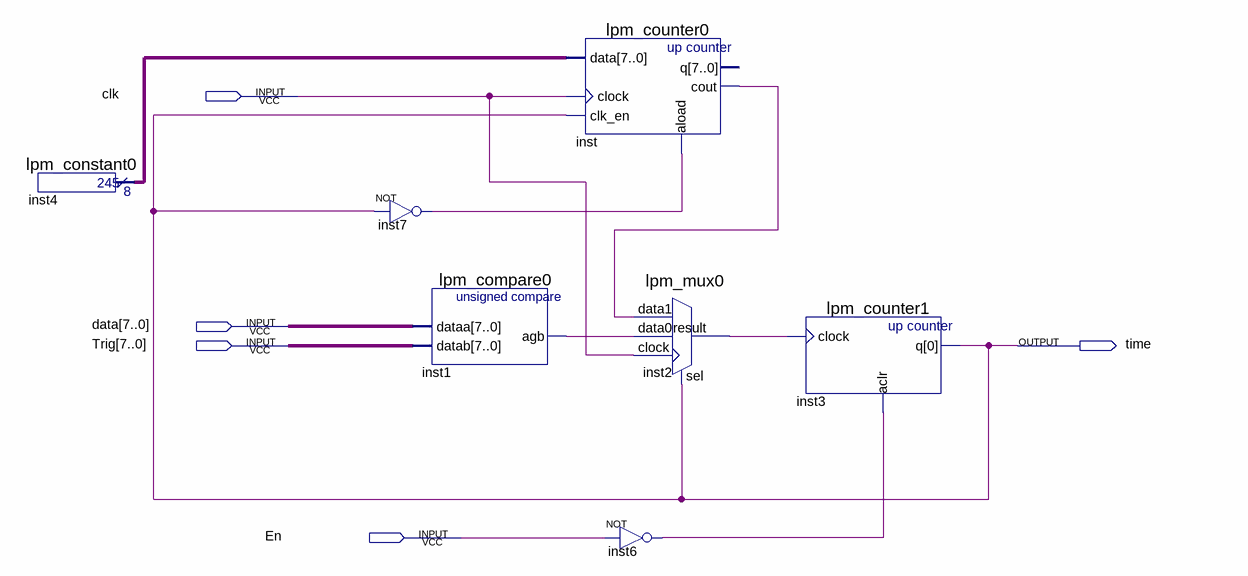
[diagram p0: schematic sheet]
// Quartus schematic time.bdf as structural Verilog: 7 symbols, 5 pins
module \time  (
  input  clk,
  input  [7:0] data,
  input  [7:0] Trig,
  input  En,
  output \time 
);

  wire inst1_agb, inst2_result, inst6_out, inst7_out, inst_cout;
  wire [7:0] inst4_result;

  lpm_constant0 inst4 (.result(inst4_result));
  not inst7 (inst7_out, \time );
  lpm_compare0 inst1 (.dataa(data), .datab(Trig), .agb(inst1_agb));
  lpm_counter0 inst (
    .data(inst4_result), .clock(clk), .clk_en(\time ), .aload(inst7_out), .cout(inst_cout));  // open: q
  lpm_mux0 inst2 (.data1(inst_cout), .data0(inst1_agb), .clock(clk), .sel(\time ), .result(inst2_result));
  not inst6 (inst6_out, En);
  lpm_counter1 inst3 (.clock(inst2_result), .aclr(inst6_out), .q(\time ));
endmodule
